# EasyEDA Pro project ProPrj_ETHlink8xADC_2025-03-31.epro, schematic ETHlink8xADC_Schematic, sheets 6 to 10 of 13

## Sheets
6 Preamp CH_2: Create Date: 2024-06-27; Page Name: Preamp CH_2; Schematic Name: Schematic1; Company: EMinc.; Part Number: 001; Reviewed: Eugenio Mancini; Version: V0.1
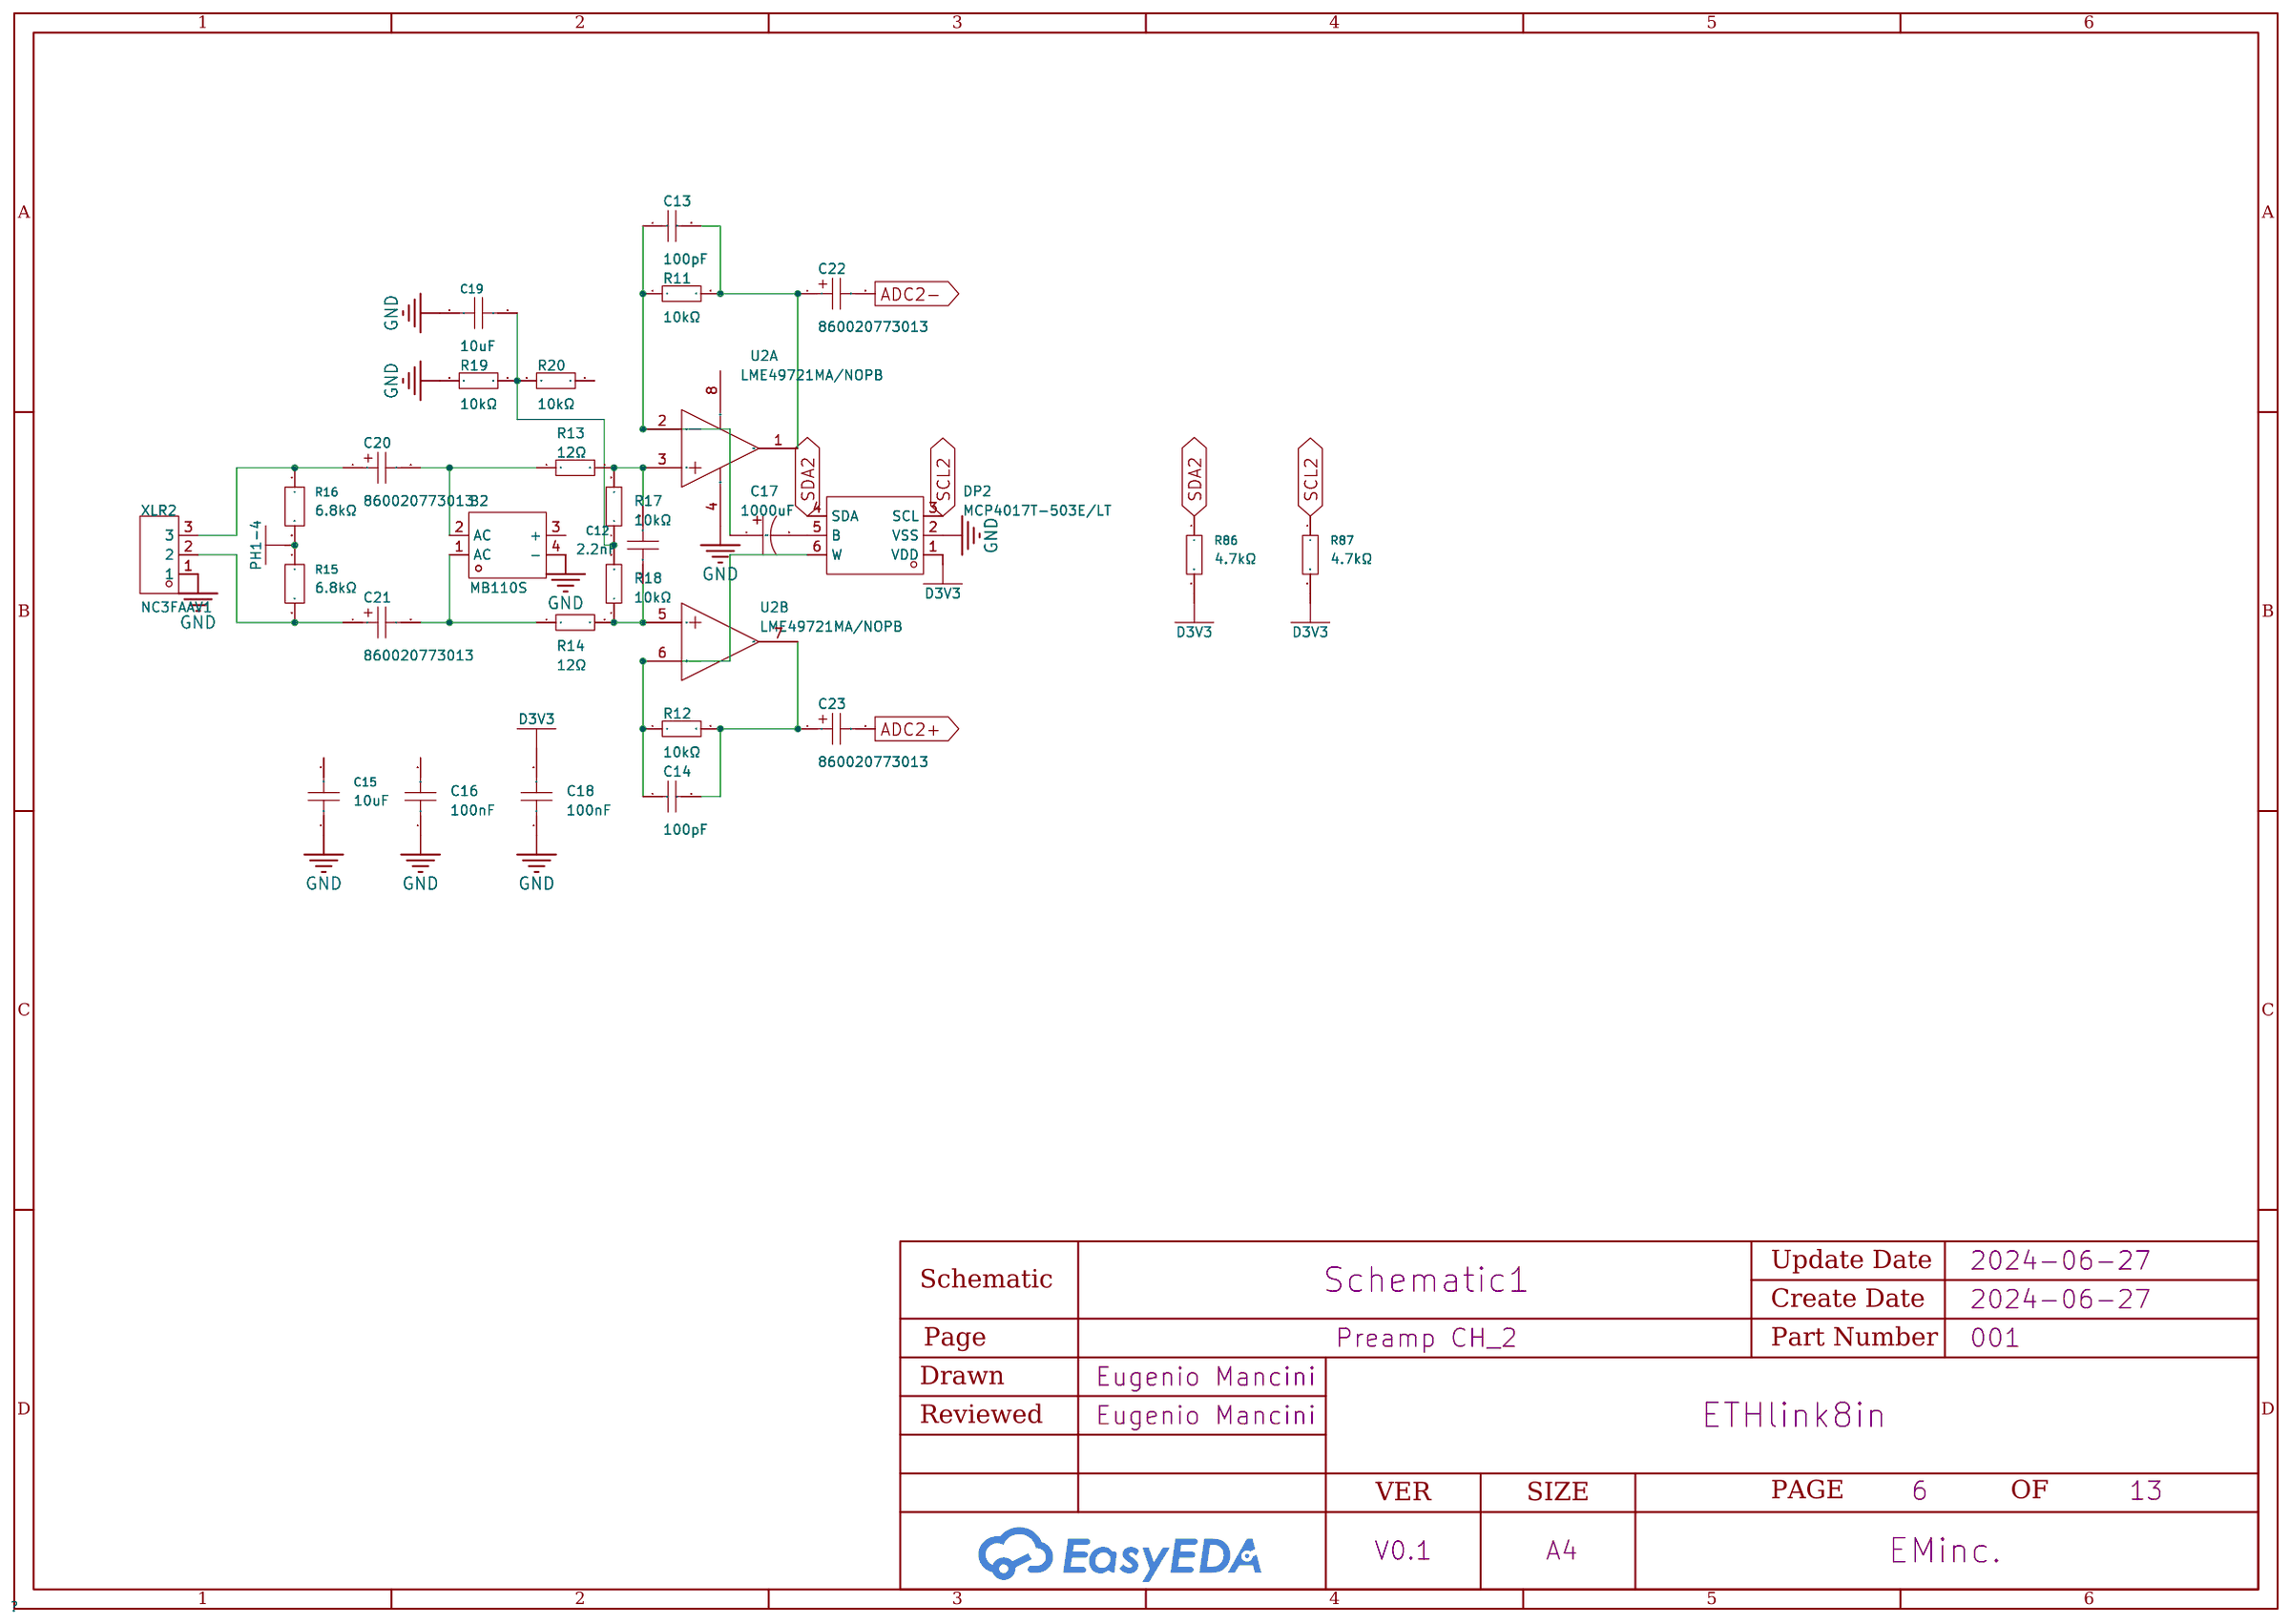
[diagram p5: Preamp CH_2]
7 Preamp CH_3: Create Date: 2024-06-27; Page Name: Preamp CH_3.Schematic1; Schematic Name: Schematic1; Company: EMinc.; Part Number: 001; Reviewed: Eugenio Mancini; Version: V0.1
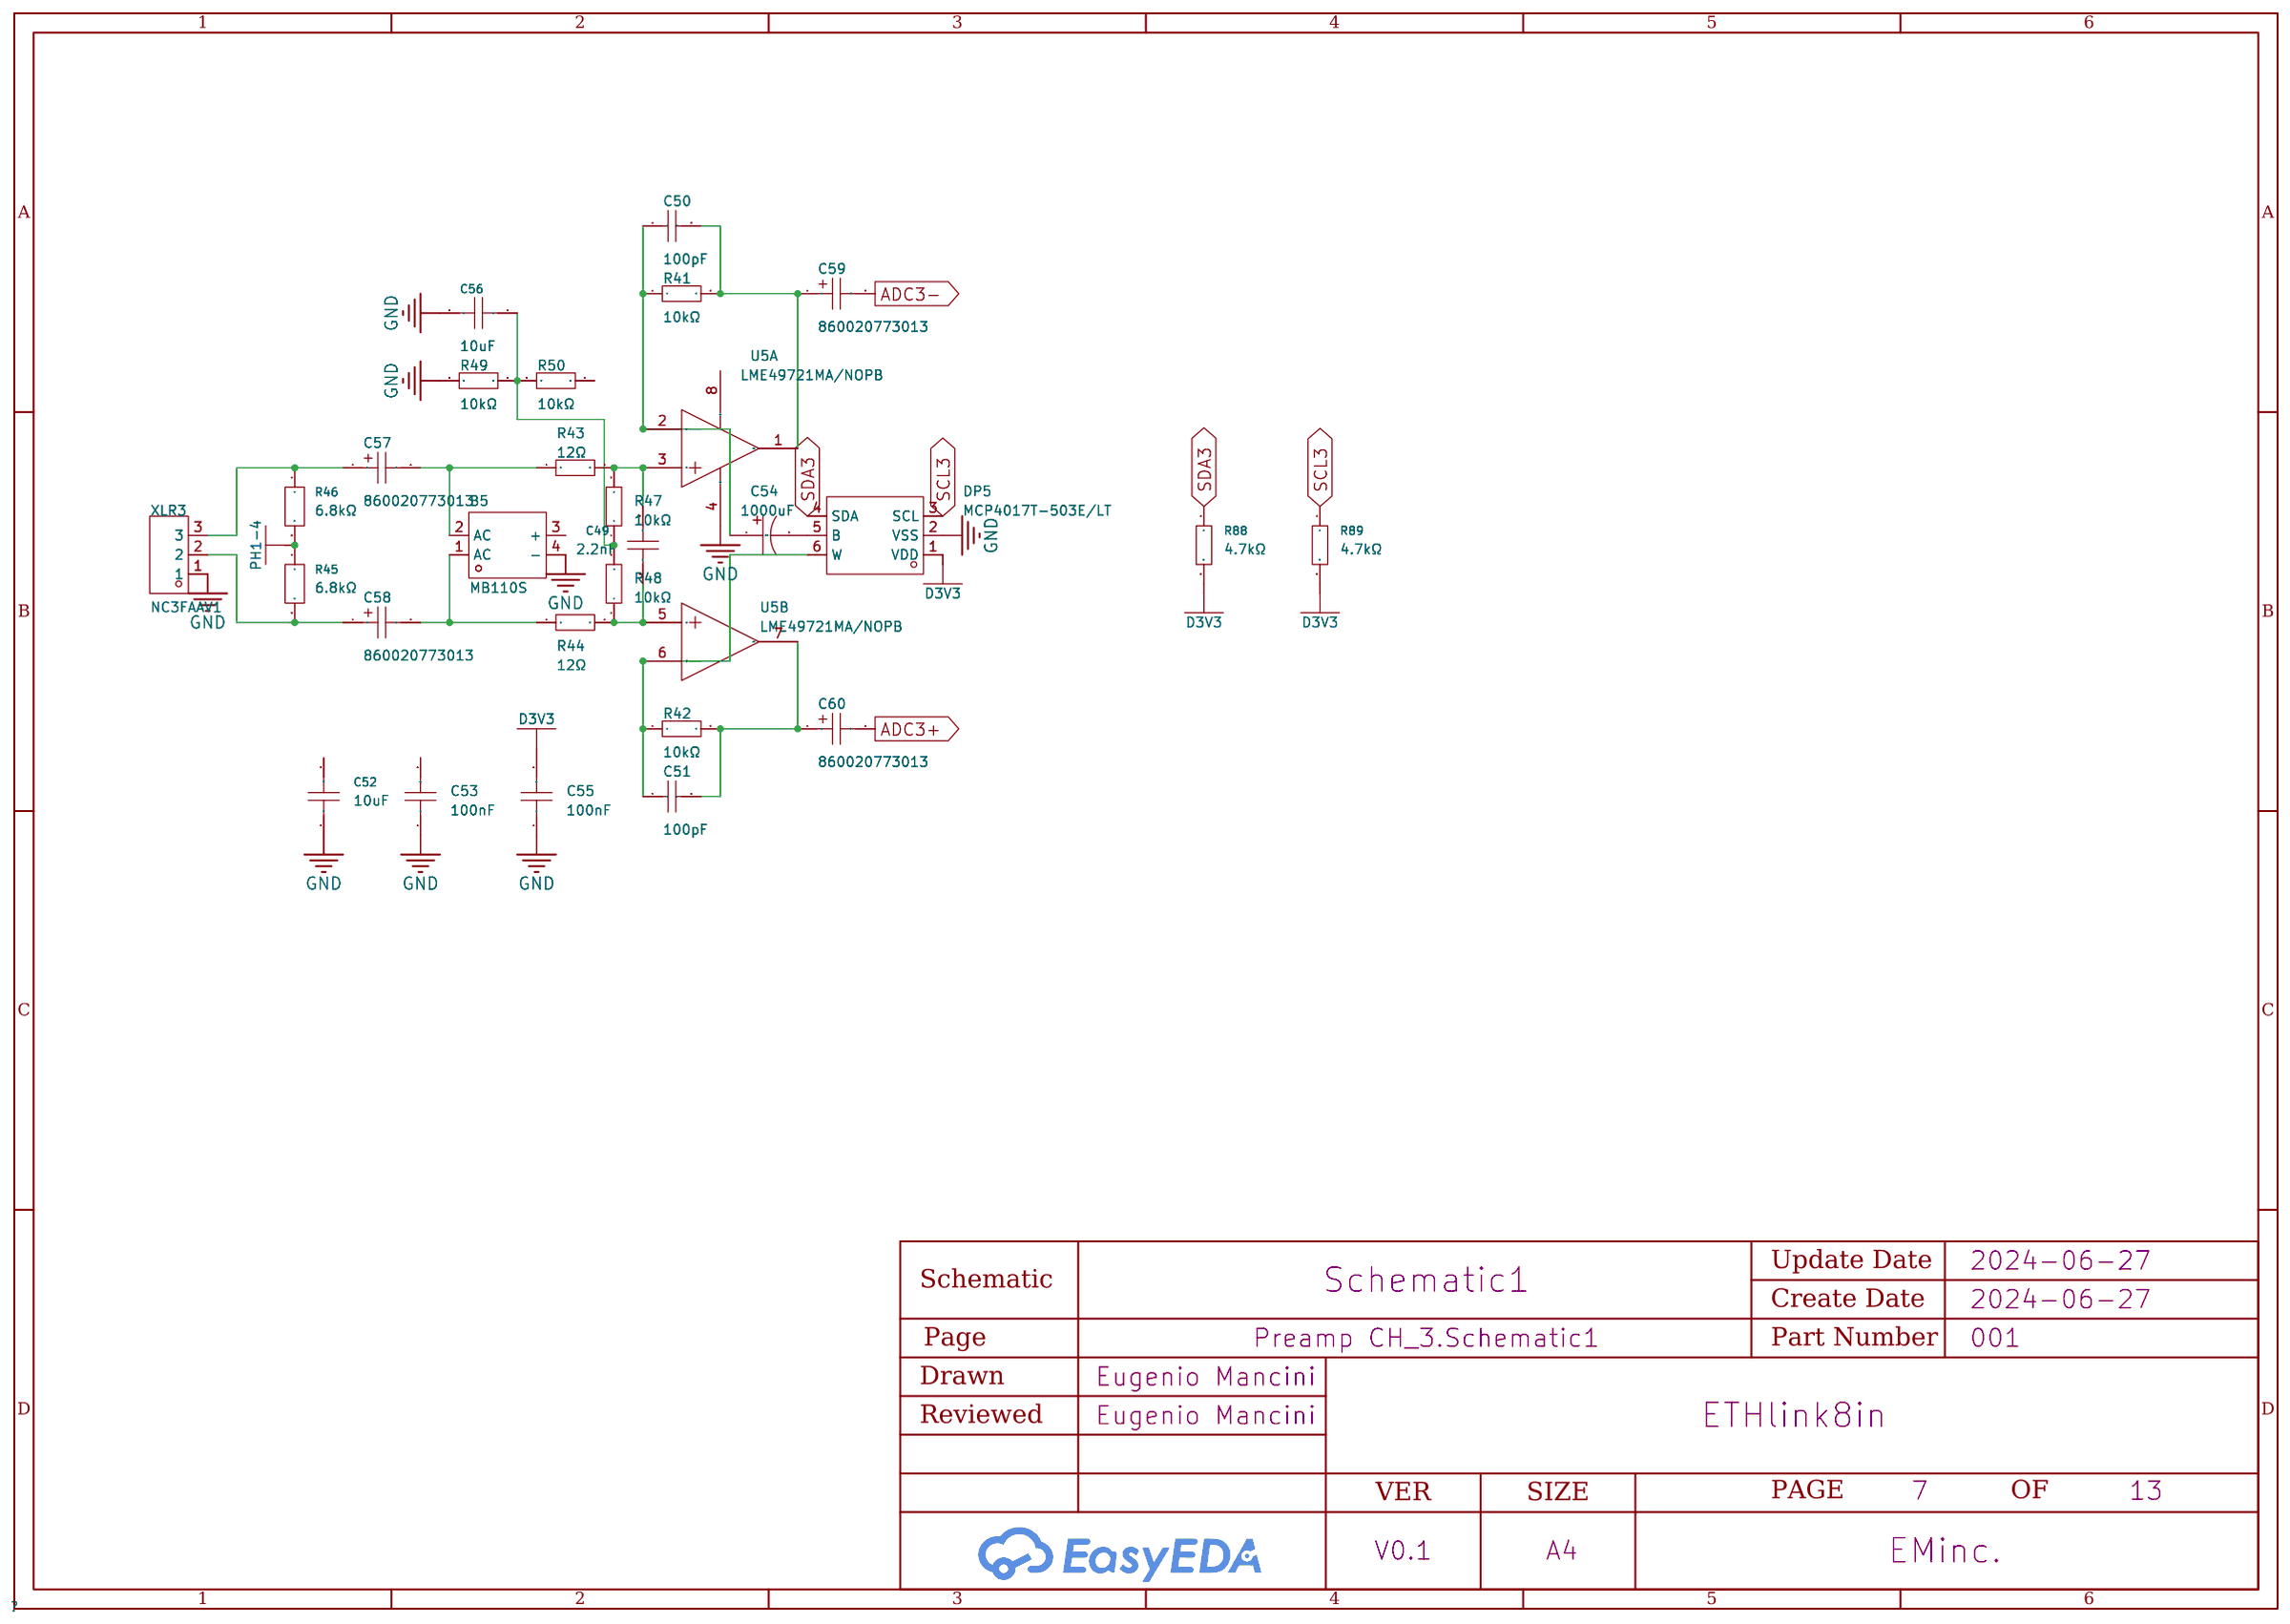
[diagram p6: Preamp CH_3]
8 Preamp CH_4: Create Date: 2024-06-27; Page Name: Preamp CH_4; Schematic Name: Schematic1; Company: EMinc.; Part Number: 001; Reviewed: Eugenio Mancini; Version: V0.1
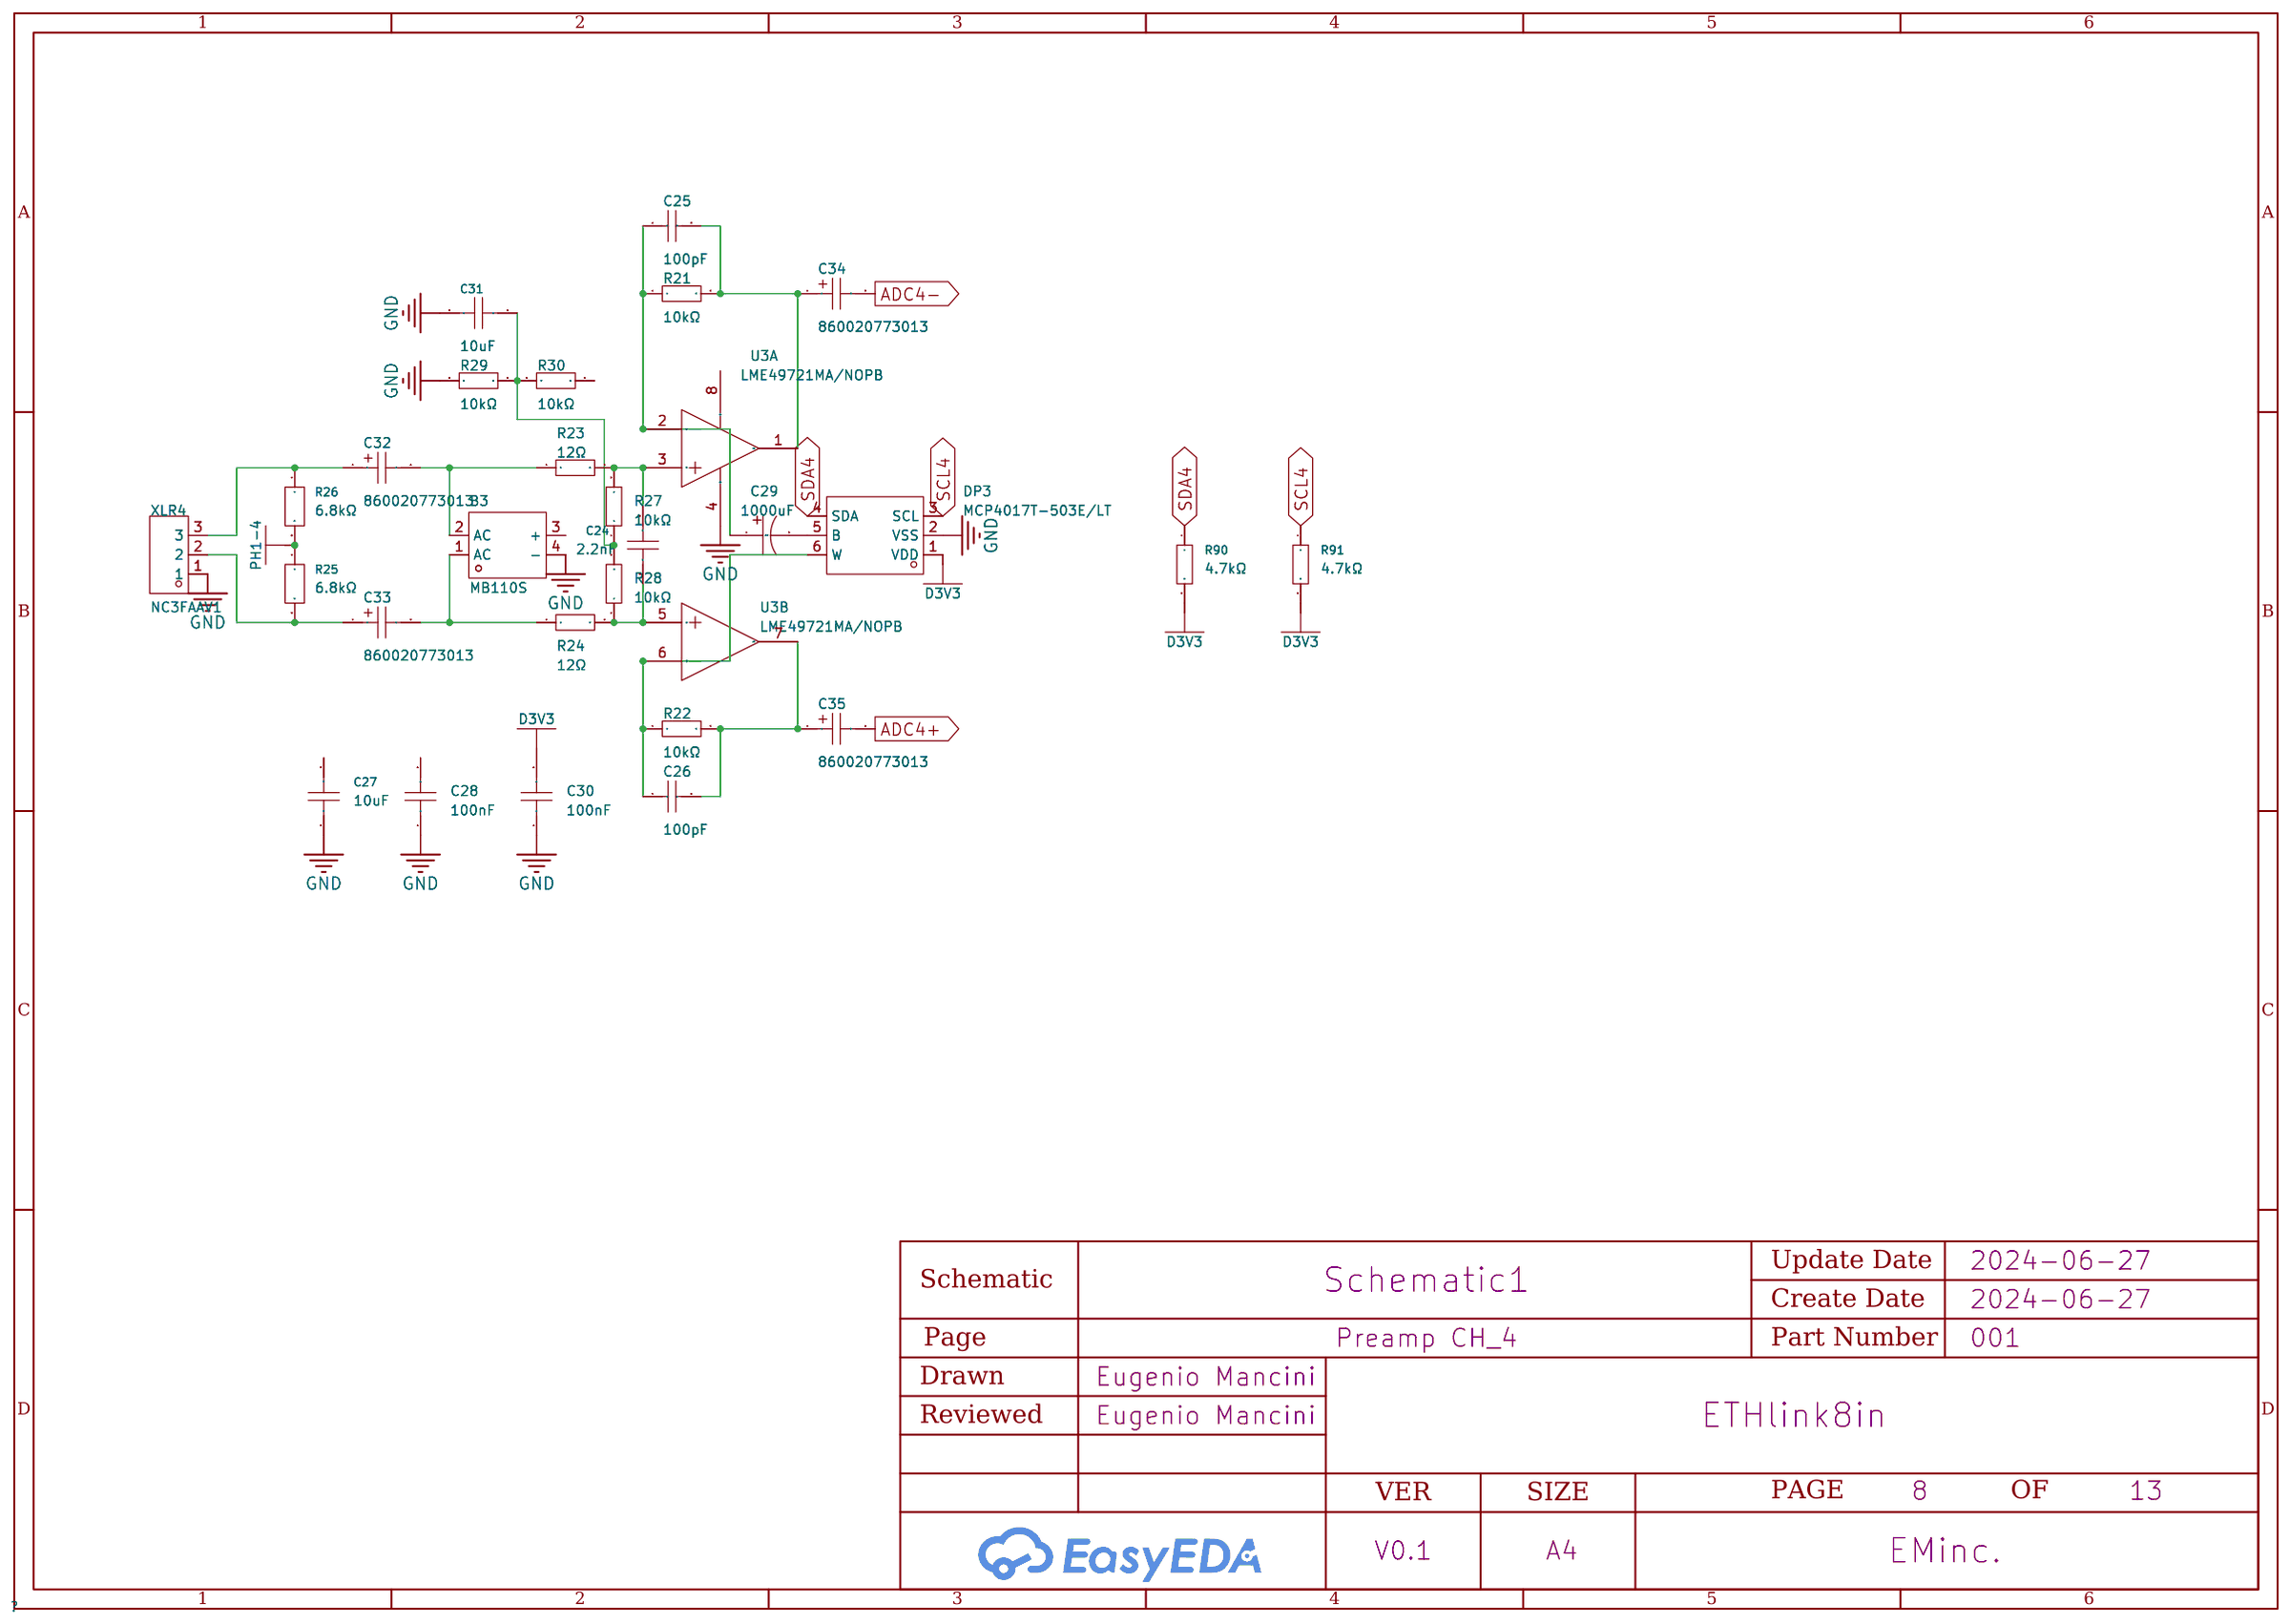
[diagram p7: Preamp CH_4]
9 Preamp CH_5: Create Date: 2024-06-27; Page Name: Preamp CH_5; Schematic Name: Schematic1; Company: EMinc.; Part Number: 001; Reviewed: Eugenio Mancini; Version: V0.1
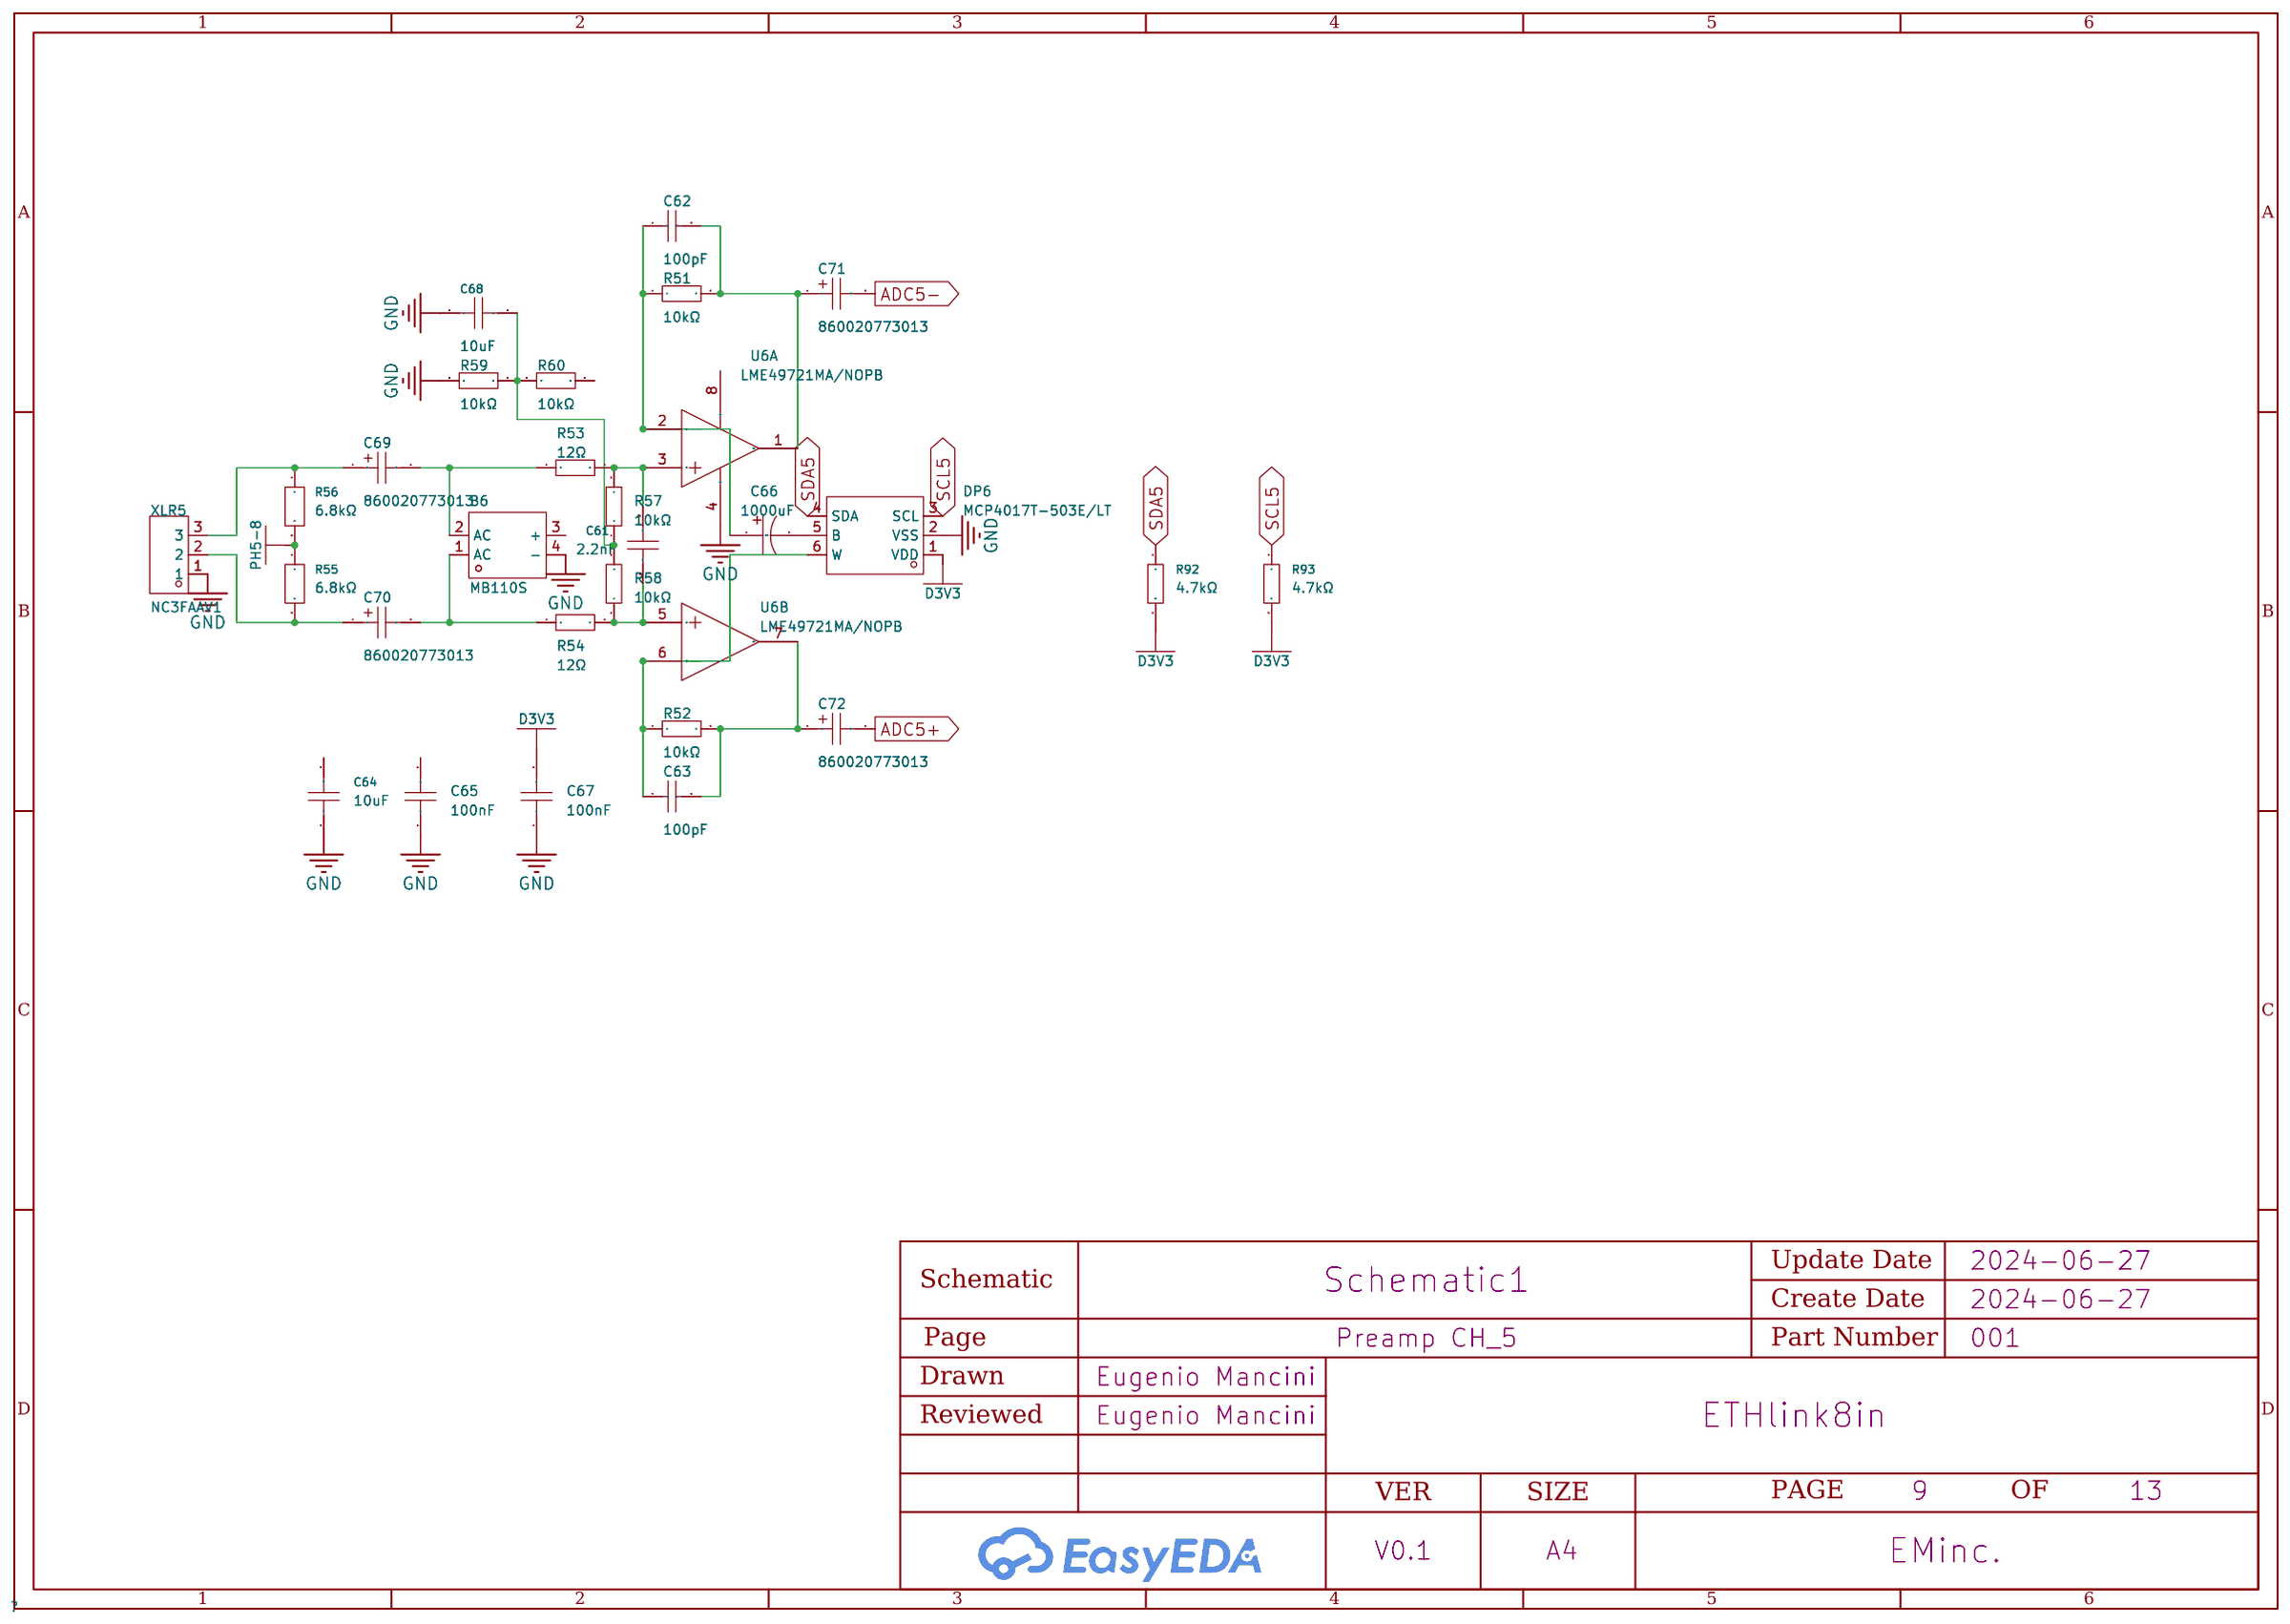
[diagram p8: Preamp CH_5]
10 Preamp CH_6: Create Date: 2024-06-27; Page Name: Preamp CH_6; Schematic Name: Schematic1; Company: EMinc.; Part Number: 001; Reviewed: Eugenio Mancini; Version: V0.1
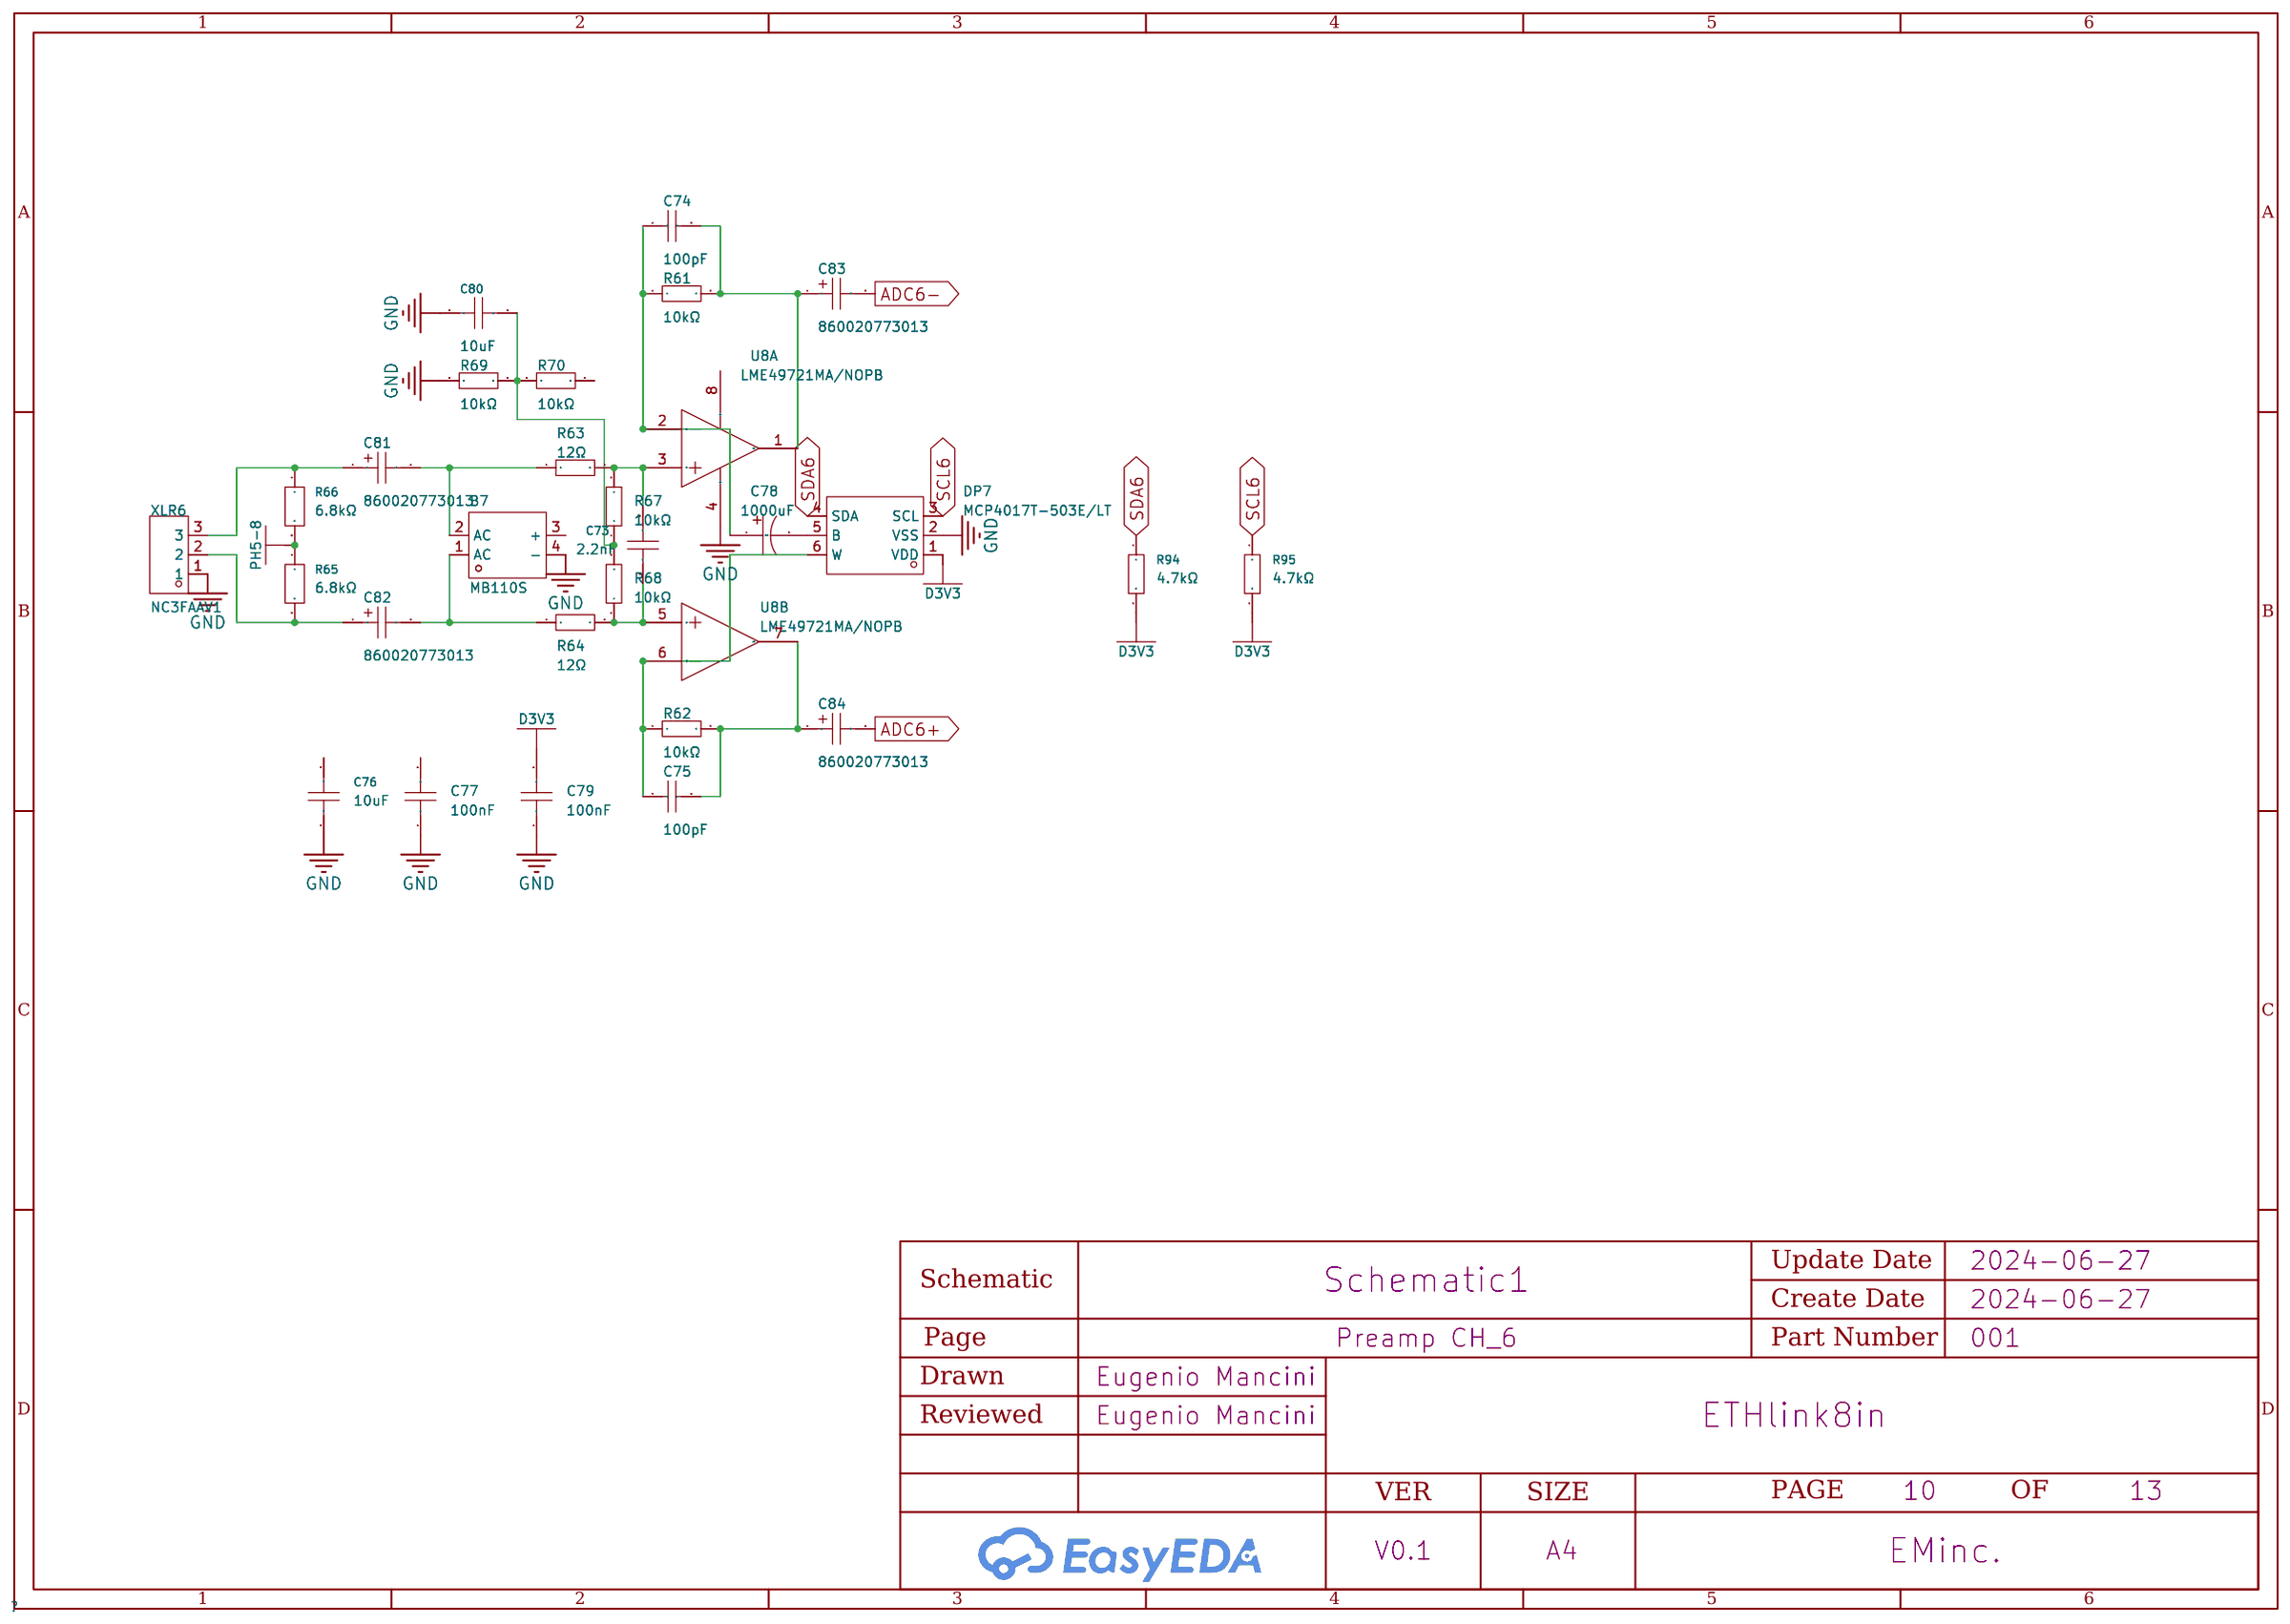
[diagram p9: Preamp CH_6]

## Parts
sheet Preamp CH_2
B2  MB110S  [MBS_L4.7-W4.0-P2.50-LS7.0-TL]
C12  2.2nF  [C0603]
C13  100pF  [C0603]
C14  100pF  [C0603]
C15  10uF  [C0603]
C16  100nF  [C0603]
C17  1000uF  [CAP-TH_BD8.0-P3.50-D0.6-FD-2]
C18  100nF  [C0603]
C19  10uF  [C0603]
C20  860020773013  [CAP-TH_BD6.3-P2.50-D0.5-FD]
C21  860020773013  [CAP-TH_BD6.3-P2.50-D0.5-FD]
C22  860020773013  [CAP-TH_BD6.3-P2.50-D0.5-FD]
C23  860020773013  [CAP-TH_BD6.3-P2.50-D0.5-FD]
DP2  MCP4017T-503E/LT  [SC-70-6_L2.0-W1.3-P0.65-LS2.1-BL]
R11  10kΩ  [R0603]
R12  10kΩ  [R0603]
R13  12Ω  [R0603]
R14  12Ω  [R0603]
R15  6.8kΩ  [R0805]
R16  6.8kΩ  [R0805]
R17  10kΩ  [R0603]
R18  10kΩ  [R0603]
R19  10kΩ  [R0603]
R20  10kΩ  [R0603]
R86  4.7kΩ  [R0603]
R87  4.7kΩ  [R0603]
U2  LME49721MA/NOPB  [SOIC-8_L4.9-W3.9-P1.27-LS6.0-BL]  (sections 1,2)
XLR2  NC3FAAV1  [CONN-TH_NC3FAAV1]
sheet Preamp CH_3
B5  MB110S  [MBS_L4.7-W4.0-P2.50-LS7.0-TL]
C49  2.2nF  [C0603]
C50  100pF  [C0603]
C51  100pF  [C0603]
C52  10uF  [C0603]
C53  100nF  [C0603]
C54  1000uF  [CAP-TH_BD8.0-P3.50-D0.6-FD-2]
C55  100nF  [C0603]
C56  10uF  [C0603]
C57  860020773013  [CAP-TH_BD6.3-P2.50-D0.5-FD]
C58  860020773013  [CAP-TH_BD6.3-P2.50-D0.5-FD]
C59  860020773013  [CAP-TH_BD6.3-P2.50-D0.5-FD]
C60  860020773013  [CAP-TH_BD6.3-P2.50-D0.5-FD]
DP5  MCP4017T-503E/LT  [SC-70-6_L2.0-W1.3-P0.65-LS2.1-BL]
R41  10kΩ  [R0603]
R42  10kΩ  [R0603]
R43  12Ω  [R0603]
R44  12Ω  [R0603]
R45  6.8kΩ  [R0805]
R46  6.8kΩ  [R0805]
R47  10kΩ  [R0603]
R48  10kΩ  [R0603]
R49  10kΩ  [R0603]
R50  10kΩ  [R0603]
R88  4.7kΩ  [R0603]
R89  4.7kΩ  [R0603]
U5  LME49721MA/NOPB  [SOIC-8_L4.9-W3.9-P1.27-LS6.0-BL]  (sections 1,2)
XLR3  NC3FAAV1  [CONN-TH_NC3FAAV1]
sheet Preamp CH_4
B3  MB110S  [MBS_L4.7-W4.0-P2.50-LS7.0-TL]
C24  2.2nF  [C0603]
C25  100pF  [C0603]
C26  100pF  [C0603]
C27  10uF  [C0603]
C28  100nF  [C0603]
C29  1000uF  [CAP-TH_BD8.0-P3.50-D0.6-FD-2]
C30  100nF  [C0603]
C31  10uF  [C0603]
C32  860020773013  [CAP-TH_BD6.3-P2.50-D0.5-FD]
C33  860020773013  [CAP-TH_BD6.3-P2.50-D0.5-FD]
C34  860020773013  [CAP-TH_BD6.3-P2.50-D0.5-FD]
C35  860020773013  [CAP-TH_BD6.3-P2.50-D0.5-FD]
DP3  MCP4017T-503E/LT  [SC-70-6_L2.0-W1.3-P0.65-LS2.1-BL]
R21  10kΩ  [R0603]
R22  10kΩ  [R0603]
R23  12Ω  [R0603]
R24  12Ω  [R0603]
R25  6.8kΩ  [R0805]
R26  6.8kΩ  [R0805]
R27  10kΩ  [R0603]
R28  10kΩ  [R0603]
R29  10kΩ  [R0603]
R30  10kΩ  [R0603]
R90  4.7kΩ  [R0603]
R91  4.7kΩ  [R0603]
U3  LME49721MA/NOPB  [SOIC-8_L4.9-W3.9-P1.27-LS6.0-BL]  (sections 1,2)
XLR4  NC3FAAV1  [CONN-TH_NC3FAAV1]
sheet Preamp CH_5
B6  MB110S  [MBS_L4.7-W4.0-P2.50-LS7.0-TL]
C61  2.2nF  [C0603]
C62  100pF  [C0603]
C63  100pF  [C0603]
C64  10uF  [C0603]
C65  100nF  [C0603]
C66  1000uF  [CAP-TH_BD8.0-P3.50-D0.6-FD-2]
C67  100nF  [C0603]
C68  10uF  [C0603]
C69  860020773013  [CAP-TH_BD6.3-P2.50-D0.5-FD]
C70  860020773013  [CAP-TH_BD6.3-P2.50-D0.5-FD]
C71  860020773013  [CAP-TH_BD6.3-P2.50-D0.5-FD]
C72  860020773013  [CAP-TH_BD6.3-P2.50-D0.5-FD]
DP6  MCP4017T-503E/LT  [SC-70-6_L2.0-W1.3-P0.65-LS2.1-BL]
R51  10kΩ  [R0603]
R52  10kΩ  [R0603]
R53  12Ω  [R0603]
R54  12Ω  [R0603]
R55  6.8kΩ  [R0805]
R56  6.8kΩ  [R0805]
R57  10kΩ  [R0603]
R58  10kΩ  [R0603]
R59  10kΩ  [R0603]
R60  10kΩ  [R0603]
R92  4.7kΩ  [R0603]
R93  4.7kΩ  [R0603]
U6  LME49721MA/NOPB  [SOIC-8_L4.9-W3.9-P1.27-LS6.0-BL]  (sections 1,2)
XLR5  NC3FAAV1  [CONN-TH_NC3FAAV1]
sheet Preamp CH_6
B7  MB110S  [MBS_L4.7-W4.0-P2.50-LS7.0-TL]
C73  2.2nF  [C0603]
C74  100pF  [C0603]
C75  100pF  [C0603]
C76  10uF  [C0603]
C77  100nF  [C0603]
C78  1000uF  [CAP-TH_BD8.0-P3.50-D0.6-FD-2]
C79  100nF  [C0603]
C80  10uF  [C0603]
C81  860020773013  [CAP-TH_BD6.3-P2.50-D0.5-FD]
C82  860020773013  [CAP-TH_BD6.3-P2.50-D0.5-FD]
C83  860020773013  [CAP-TH_BD6.3-P2.50-D0.5-FD]
C84  860020773013  [CAP-TH_BD6.3-P2.50-D0.5-FD]
DP7  MCP4017T-503E/LT  [SC-70-6_L2.0-W1.3-P0.65-LS2.1-BL]
R61  10kΩ  [R0603]
R62  10kΩ  [R0603]
R63  12Ω  [R0603]
R64  12Ω  [R0603]
R65  6.8kΩ  [R0805]
R66  6.8kΩ  [R0805]
R67  10kΩ  [R0603]
R68  10kΩ  [R0603]
R69  10kΩ  [R0603]
R70  10kΩ  [R0603]
R94  4.7kΩ  [R0603]
R95  4.7kΩ  [R0603]
U8  LME49721MA/NOPB  [SOIC-8_L4.9-W3.9-P1.27-LS6.0-BL]  (sections 1,2)
XLR6  NC3FAAV1  [CONN-TH_NC3FAAV1]

## Library data of the parts
B2 B3 B5-B7 = MB110S: Forward Voltage (Vf@If):900mV@1A Reverse Voltage (Vr): Average Rectified Current (Io): Reverse Leakage Current (Ir):100uA@100V Peak Forward Surge Current: Operating Temperature:-55℃~+150℃@(Tj) Operating Temperature:-55℃~+150℃@(Tj); LCSC Part Name: 电压:100V 电流:1A; Supplier Part: C94545; Manufacturer: MDD(辰达半导体); Supplier Footprint: MBS; JLCPCB Part Class: Extended Part; Datasheet: https://atta.szlcsc.com/upload/public/pdf/source/20230823/CF8E6B9D12CAED444661F971FB52D378.pdf; Supplier: LCSC; Forward Voltage (Vf@If): 900mV@1A; Reverse Leakage Current (Ir): 100uA@100V; Operating Temperature: -55℃~+150℃@(Tj)
C12 C24 C49 C61 C73 = GRM1885C1H222JA01D: Capacitance: Tolerance:±5% Tolerance:±5% Voltage Rated: Temperature Coefficient:; LCSC Part Name: 2.2nF ±5% 50V; Supplier Part: C77033; Manufacturer: muRata(村田); Supplier Footprint: 0603; JLCPCB Part Class: Extended Part; Datasheet: https://atta.szlcsc.com/upload/public/pdf/source/20200305/C490387_23319AE8C154DEB24C505E6C82A8106A.pdf; Supplier: LCSC; Tolerance: ±5%
C13 C14 C25 C26 C50 C51 C62 C63 C74 C75 = CL10C101JB8NNNC: Capacitance: Tolerance:±5% Tolerance:±5% Voltage Rated: Temperature Coefficient:; LCSC Part Name: 100pF ±5% 50V; Supplier Part: C14858; Manufacturer: SAMSUNG(三星); Supplier Footprint: 0603; JLCPCB Part Class: Basic Part; Datasheet: https://atta.szlcsc.com/upload/public/pdf/source/20160218/1457707763339.pdf; Supplier: LCSC; Tolerance: ±5%
C15 C19 C27 C31 C52 C56 C64 C68 C76 C80 = CL10A106MQ8NNNC: Capacitance: Tolerance:±20% Tolerance:±20% Voltage Rated: Temperature Coefficient:; LCSC Part Name: 10uF ±20% 6.3V; Supplier Part: C1691; Manufacturer: SAMSUNG(三星); Supplier Footprint: 0603; JLCPCB Part Class: Extended Part; Datasheet: https://atta.szlcsc.com/upload/public/pdf/source/20160218/1457707763339.pdf; Supplier: LCSC; Tolerance: ±20%
C16 C18 C28 C30 C53 C55 C65 C67 C77 C79 = CL10B104KC8NNNC: Capacitance: Tolerance:±10% Tolerance:±10% Voltage Rated: Temperature Coefficient:; LCSC Part Name: 100nF ±10% 100V; Supplier Part: C15725; Manufacturer: SAMSUNG(三星); Supplier Footprint: 0603; JLCPCB Part Class: Extended Part; Datasheet: https://atta.szlcsc.com/upload/public/pdf/source/20160218/1457707763339.pdf; Supplier: LCSC; Tolerance: ±10%
C17 C29 C54 C66 C78 = 6.3YXS1000MEFC8X11.5: Capacitance: Tolerance:±20% Tolerance:±20% Rated Voltage: Ripple Current:438mA@120Hz Equivalent Series Resistance(ESR):- Lead Spacing: φD: L: Lifetime @ Temp:4000hrs@105℃ Operating Temperature:-40℃~+105℃ Operating Temperature:-40℃~+105℃; LCSC Part Name: 1000uF ±20% 6.3V; Supplier Part: C5115430; Manufacturer: rubycon(红宝石); Supplier Footprint: 插件,D8xL11.5mm; JLCPCB Part Class: Extended Part; Datasheet: https://atta.szlcsc.com/upload/public/pdf/source/20221128/8AD20EA7405F8C40BF758105C4820F47.pdf; Supplier: LCSC; Tolerance: ±20%; Ripple Current: 438mA@120Hz; Lifetime @ Temp: 4000hrs@105℃; Operating Temperature: -40℃~+105℃
C20-C23 C32-C35 C57-C60 C69-C72 C81-C84 = 860020773013: Supplier Part: C7046938; Manufacturer: Wurth(伍尔特); Supplier Footprint: 插件; JLCPCB Part Class: Extended Part; Datasheet: https://atta.szlcsc.com/upload/public/pdf/source/20231023/860020773013.pdf-ae4cc118506be8cf0bae152b6102cbee.pdf; Supplier: LCSC
DP2 DP3 DP5-DP7 = MCP4017T-503E/LT: Resistance Value (Ohms):50kΩ Number of Taps:128 Interface Type:I2C Number of Channels:1 Supply Voltage:1.8V~5.5V Supply Voltage:1.8V~5.5V Precision:±20% Precision:±20% Temperature Coefficient (Typ):150ppm/℃ Temperature Coefficient (Typ):150ppm/℃ Operating; Supplier Part: C478095; Manufacturer: MICROCHIP(美国微芯); Supplier Footprint: SC-70-6; JLCPCB Part Class: Extended Part; Datasheet: https://atta.szlcsc.com/upload/public/pdf/source/20171212/C145561_15130636359521177681.pdf; Supplier: LCSC; Resistance Value (Ohms): 50kΩ; Number of Taps: 128; Interface Type: I2C; Number of Channels: 1; Supply Voltage: 1.8V~5.5V; Precision: ±20%; Temperature Coefficient (Typ): 150ppm/℃; Operating Temperature: -40℃~+125℃
R11 R12 R17-R22 R27-R30 R41 R42 R47-R52 R57-R62 R67-R70 = RC0603FR-0710KL: Type:Thick Film Resistors Resistance: Tolerance:±1% Tolerance:±1% Power(Watts): Overload Voltage (Max): Temperature Coefficient:±100ppm/℃ Temperature Coefficient:±100ppm/℃ Operating Temperature Range:-55℃~+155℃ Operating Temperature Range:-55℃~+155℃; LCSC Part Name: 厚膜电阻 10kΩ ±1% 100mW; Supplier Part: C98220; Manufacturer: YAGEO(国巨); Supplier Footprint: 0603; JLCPCB Part Class: Extended Part; Datasheet: https://atta.szlcsc.com/upload/public/pdf/source/20180927/C295883_E8D83085EA81BD7DE0B2B681138C15EE.pdf; Supplier: LCSC; Type: Thick Film Resistors; Tolerance: ±1%; Temperature Coefficient: ±100ppm/℃; Operating Temperature Range: -55℃~+155℃
R13 R14 R23 R24 R43 R44 R53 R54 R63 R64 = RC0603FR-0712RL: Type:Thick Film Resistors Resistance: Tolerance:±1% Tolerance:±1% Power(Watts): Overload Voltage (Max): Temperature Coefficient:±100ppm/℃ Temperature Coefficient:±100ppm/℃ Operating Temperature Range:-55℃~+155℃ Operating Temperature Range:-55℃~+155℃; LCSC Part Name: 厚膜电阻 12Ω ±1% 100mW; Supplier Part: C245909; Manufacturer: YAGEO(国巨); Supplier Footprint: 0603; JLCPCB Part Class: Extended Part; Datasheet: https://atta.szlcsc.com/upload/public/pdf/source/20181031/C326976_E9901E35333D136A19B6CE377E889A82.pdf; Supplier: LCSC; Type: Thick Film Resistors; Tolerance: ±1%; Temperature Coefficient: ±100ppm/℃; Operating Temperature Range: -55℃~+155℃
R15 R16 R25 R26 R45 R46 R55 R56 R65 R66 = AS05W2J0682T5E: Type:Thick Film Resistors Resistance:6.8kΩ Tolerance:±5% Tolerance:±5% Power(Watts): Overload Voltage (Max): Temperature Coefficient:±100ppm/℃ Temperature Coefficient:±100ppm/℃ Operating Temperature Range:-55℃~+155℃ Operating Temperature Range:-55℃~+155℃; LCSC Part Name: 6.8kΩ ±5% 500mW 厚膜电阻; Supplier Part: C560550; Manufacturer: UNI-ROYAL(厚声); Supplier Footprint: 0805; JLCPCB Part Class: Extended Part; Datasheet: https://atta.szlcsc.com/upload/public/pdf/source/20200723/C560412_34ABBCC623B52ADD707B94178459E29E.pdf; Supplier: LCSC; Type: Thick Film Resistors; Tolerance: ±5%; Temperature Coefficient: ±100ppm/℃; Operating Temperature Range: -55℃~+155℃
R86-R95 = 0603WAF4701T5E: Type:Thick Film Resistors Resistance:4.7kΩ Tolerance:±1% Tolerance:±1% Power(Watts): Overload Voltage (Max): Temperature Coefficient:±100ppm/℃ Temperature Coefficient:±100ppm/℃ Operating Temperature Range:-55℃~+155℃ Operating Temperature Range:-55℃~+155℃; LCSC Part Name: 4.7kΩ ±1% 100mW 厚膜电阻; Supplier Part: C23162; Manufacturer: UNI-ROYAL(厚声); Supplier Footprint: 0603; JLCPCB Part Class: Basic Part; Datasheet: https://atta.szlcsc.com/upload/public/pdf/source/20200306/C422600_1E6D84923E4A46A82E41ADD87F860B5C.pdf; Supplier: LCSC; Type: Thick Film Resistors; Tolerance: ±1%; Temperature Coefficient: ±100ppm/℃; Operating Temperature Range: -55℃~+155℃
U2 U3 U5 U6 U8 = LME49721MA/NOPB: Type of Power Amplifier: Speaker Channels:双声道 Output Power: Supply Voltage:- Supply Voltage:- Operating Temperature:-40℃~+85℃ Operating Temperature:-40℃~+85℃; Supplier Part: C1348133; Manufacturer: TI(德州仪器); Supplier Footprint: SOIC-8; JLCPCB Part Class: Extended Part; Datasheet: https://www.ti.com/cn/lit/gpn/lme49721; Supplier: LCSC; Speaker Channels: 双声道; Operating Temperature: -40℃~+85℃
XLR2-XLR6 = NC3FAAV1: Connector Type:XLR母插座 Current Rating (Max):- Operating Temperature Range:- Operating Temperature Range:-; Supplier Part: C368513; Manufacturer: NEUTRIK(优曲克); Supplier Footprint: 插件; JLCPCB Part Class: Extended Part; Datasheet: https://atta.szlcsc.com/upload/public/pdf/source/20190222/C368513_3D2EA58256C0ABD92AA33704412093B5.pdf; Supplier: LCSC; Connector Type: XLR母插座

## Nets
A3V3: B2.3(+) B3.3(+) B5.3(+) B6.3(+) B7.3(+) C15.2 C16.2 C27.2 C28.2 C52.2 C53.2 C64.2 C65.2 C76.2 C77.2 R20.1 R30.1 R50.1 R60.1 R70.1 U2.8(VDD) U3.8(VDD) U5.8(VDD) U6.8(VDD) U8.8(VDD) ; also on sheet 1 5 11 12 13
D3V3: C18.2 C30.2 C55.2 C67.2 C79.2 DP2.1(VDD) DP3.1(VDD) DP5.1(VDD) DP6.1(VDD) DP7.1(VDD) R86.2 R87.2 R88.2 R89.2 R90.2 R91.2 R92.2 R93.2 R94.2 R95.2 ; also on sheet 1 2 3 4 5 11 12 13
GND: B2.4(-) B3.4(-) B5.4(-) B6.4(-) B7.4(-) C15.1 C16.1 C18.1 C19.1 C27.1 C28.1 C30.1 C31.1 C52.1 C53.1 C55.1 C56.1 C64.1 C65.1 C67.1 C68.1 C76.1 C77.1 C79.1 C80.1 DP2.2(VSS) DP3.2(VSS) DP5.2(VSS) DP6.2(VSS) DP7.2(VSS) R19.2 R29.2 R49.2 R59.2 R69.2 U2.4(VSS) U3.4(VSS) U5.4(VSS) U6.4(VSS) U8.4(VSS) XLR2.1 XLR3.1 XLR4.1 XLR5.1 XLR6.1 ; also on sheet 1 2 3 4 5 11 12 13
ADC2+: C23.2 ; also on sheet 13
ADC2-: C22.2 ; also on sheet 13
ADC3+: C60.2 ; also on sheet 13
ADC3-: C59.2 ; also on sheet 13
ADC4+: C35.2 ; also on sheet 13
ADC4-: C34.2 ; also on sheet 13
ADC5+: C72.2 ; also on sheet 13
ADC5-: C71.2 ; also on sheet 13
ADC6+: C84.2 ; also on sheet 13
ADC6-: C83.2 ; also on sheet 13
PH1-4: R15.1 R16.2 R25.1 R26.2 R45.1 R46.2 ; also on sheet 5 13
PH5-8: R55.1 R56.2 R65.1 R66.2 ; also on sheet 11 12 13
SCL2: DP2.3(SCL) R87.1 ; also on sheet 13
SCL3: DP5.3(SCL) R89.1 ; also on sheet 13
SCL4: DP3.3(SCL) R91.1 ; also on sheet 13
SCL5: DP6.3(SCL) R93.1 ; also on sheet 13
SCL6: DP7.3(SCL) R95.1 ; also on sheet 13
SDA2: DP2.4(SDA) R86.1 ; also on sheet 13
SDA3: DP5.4(SDA) R88.1 ; also on sheet 13
SDA4: DP3.4(SDA) R90.1 ; also on sheet 13
SDA5: DP6.4(SDA) R92.1 ; also on sheet 13
SDA6: DP7.4(SDA) R94.1 ; also on sheet 13
$7N1968: C14.2 C23.1 R12.2 U2.7(OUT B)
$7N1989: C13.2 C22.1 R11.2 U2.1(OUT A)
$7N2290: C14.1 DP2.6(W) R12.1 U2.6(IN B-)
$7N2380: C17.2 DP2.5(B)
$7N2424: C13.1 C17.1 R11.1 U2.2(IN A-)
$7N2717: C19.2 R17.1 R18.2 R19.1 R20.2
$7N2736: B2.2(AC) C20.2 R13.1
$7N2751: B2.1(AC) C21.2 R14.1
$7N21114: C20.1 R16.1 XLR2.3
$7N21120: C21.1 R15.2 XLR2.2
$7N21876: C12.1 R14.2 R18.1 U2.5(IN B+)
$7N21880: C12.2 R13.2 R17.2 U2.3(IN A+)
$8N1968: C51.2 C60.1 R42.2 U5.7(OUT B)
$8N1989: C50.2 C59.1 R41.2 U5.1(OUT A)
$8N2290: C51.1 DP5.6(W) R42.1 U5.6(IN B-)
$8N2380: C54.2 DP5.5(B)
$8N2424: C50.1 C54.1 R41.1 U5.2(IN A-)
$8N2717: C56.2 R47.1 R48.2 R49.1 R50.2
$8N2736: B5.2(AC) C57.2 R43.1
$8N2751: B5.1(AC) C58.2 R44.1
$8N20419: C57.1 R46.1 XLR3.3
$8N20425: C58.1 R45.2 XLR3.2
$8N21165: C49.2 R43.2 R47.2 U5.3(IN A+)
$8N21169: C49.1 R44.2 R48.1 U5.5(IN B+)
$9N1968: C26.2 C35.1 R22.2 U3.7(OUT B)
$9N1989: C25.2 C34.1 R21.2 U3.1(OUT A)
$9N2290: C26.1 DP3.6(W) R22.1 U3.6(IN B-)
$9N2380: C29.2 DP3.5(B)
$9N2424: C25.1 C29.1 R21.1 U3.2(IN A-)
$9N2717: C31.2 R27.1 R28.2 R29.1 R30.2
$9N2736: B3.2(AC) C32.2 R23.1
$9N2751: B3.1(AC) C33.2 R24.1
$9N21811: C32.1 R26.1 XLR4.3
$9N21817: C33.1 R25.2 XLR4.2
$9N22564: C24.2 R23.2 R27.2 U3.3(IN A+)
$9N22568: C24.1 R24.2 R28.1 U3.5(IN B+)
$10N1968: C63.2 C72.1 R52.2 U6.7(OUT B)
$10N1989: C62.2 C71.1 R51.2 U6.1(OUT A)
$10N2290: C63.1 DP6.6(W) R52.1 U6.6(IN B-)
$10N2380: C66.2 DP6.5(B)
$10N2424: C62.1 C66.1 R51.1 U6.2(IN A-)
$10N2717: C68.2 R57.1 R58.2 R59.1 R60.2
$10N2736: B6.2(AC) C69.2 R53.1
$10N2751: B6.1(AC) C70.2 R54.1
$10N20419: C69.1 R56.1 XLR5.3
$10N20425: C70.1 R55.2 XLR5.2
$10N21165: C61.2 R53.2 R57.2 U6.3(IN A+)
$10N21169: C61.1 R54.2 R58.1 U6.5(IN B+)
$11N1968: C75.2 C84.1 R62.2 U8.7(OUT B)
$11N1989: C74.2 C83.1 R61.2 U8.1(OUT A)
$11N2290: C75.1 DP7.6(W) R62.1 U8.6(IN B-)
$11N2380: C78.2 DP7.5(B)
$11N2424: C74.1 C78.1 R61.1 U8.2(IN A-)
$11N2717: C80.2 R67.1 R68.2 R69.1 R70.2
$11N2736: B7.2(AC) C81.2 R63.1
$11N2751: B7.1(AC) C82.2 R64.1
$11N21809: C81.1 R66.1 XLR6.3
$11N21815: C82.1 R65.2 XLR6.2
$11N22566: C73.2 R63.2 R67.2 U8.3(IN A+)
$11N22570: C73.1 R64.2 R68.1 U8.5(IN B+)
